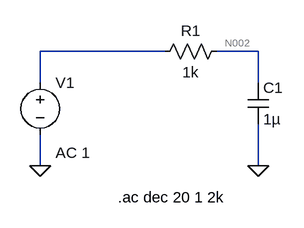
[diagram p0: schematic passive filter.asc]
passive filter.asc, the LTspice schematic file:
Version 4
SHEET 1 880 680
WIRE 128 96 -64 96
WIRE 272 96 208 96
WIRE -64 144 -64 96
WIRE 272 144 272 96
WIRE -64 272 -64 224
WIRE 272 272 272 208
FLAG -64 272 0
FLAG 272 272 0
SYMBOL voltage -64 128 R0
WINDOW 123 24 124 Left 2
WINDOW 39 0 0 Left 0
SYMATTR InstName V1
SYMATTR Value ""
SYMATTR Value2 AC 1
SYMBOL res 224 80 R90
WINDOW 0 0 56 VBottom 2
WINDOW 3 32 56 VTop 2
SYMATTR InstName R1
SYMATTR Value 1k
SYMBOL cap 256 144 R0
SYMATTR InstName C1
SYMATTR Value 1µ
TEXT 56 320 Left 2 !.ac dec 20 1 2k

The netlist it stands for:
* passive filter.asc
V1 N001 0 AC 1
R1 N002 N001 1k
C1 N002 0 1µ
.ac dec 20 1 2k
.backanno
.end

* Results of the author's LTspice run, read from the files saved beside the schematic
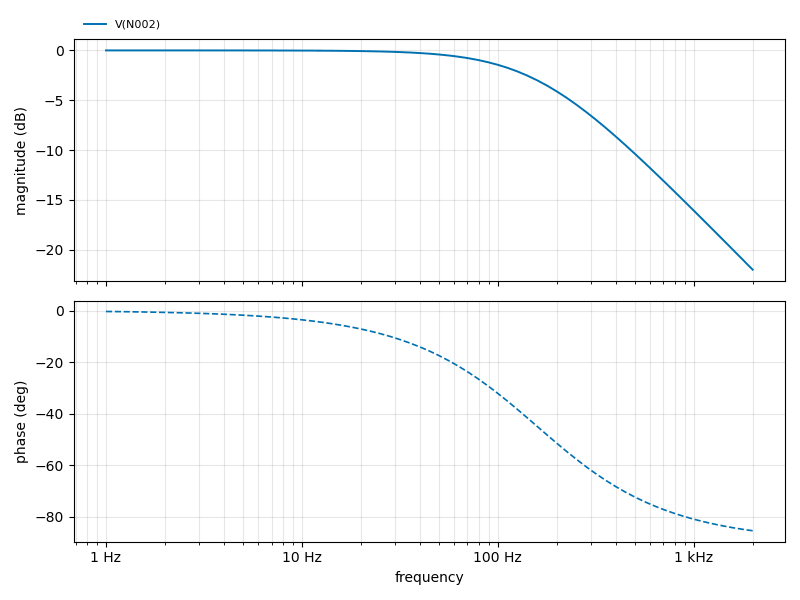
[diagram p1: AC Analysis of passive filter.asc, plotted from the saved traces]
* AC Analysis, 1 run:
*   V(N002): -0.00 dB at 1 Hz, -22.01 dB at 2 kHz, peak -0.00 dB at 1 Hz, 3 dB below the peak at 159.1 Hz